# Altium schematic sheet 05_RS485.SchDoc
size A3
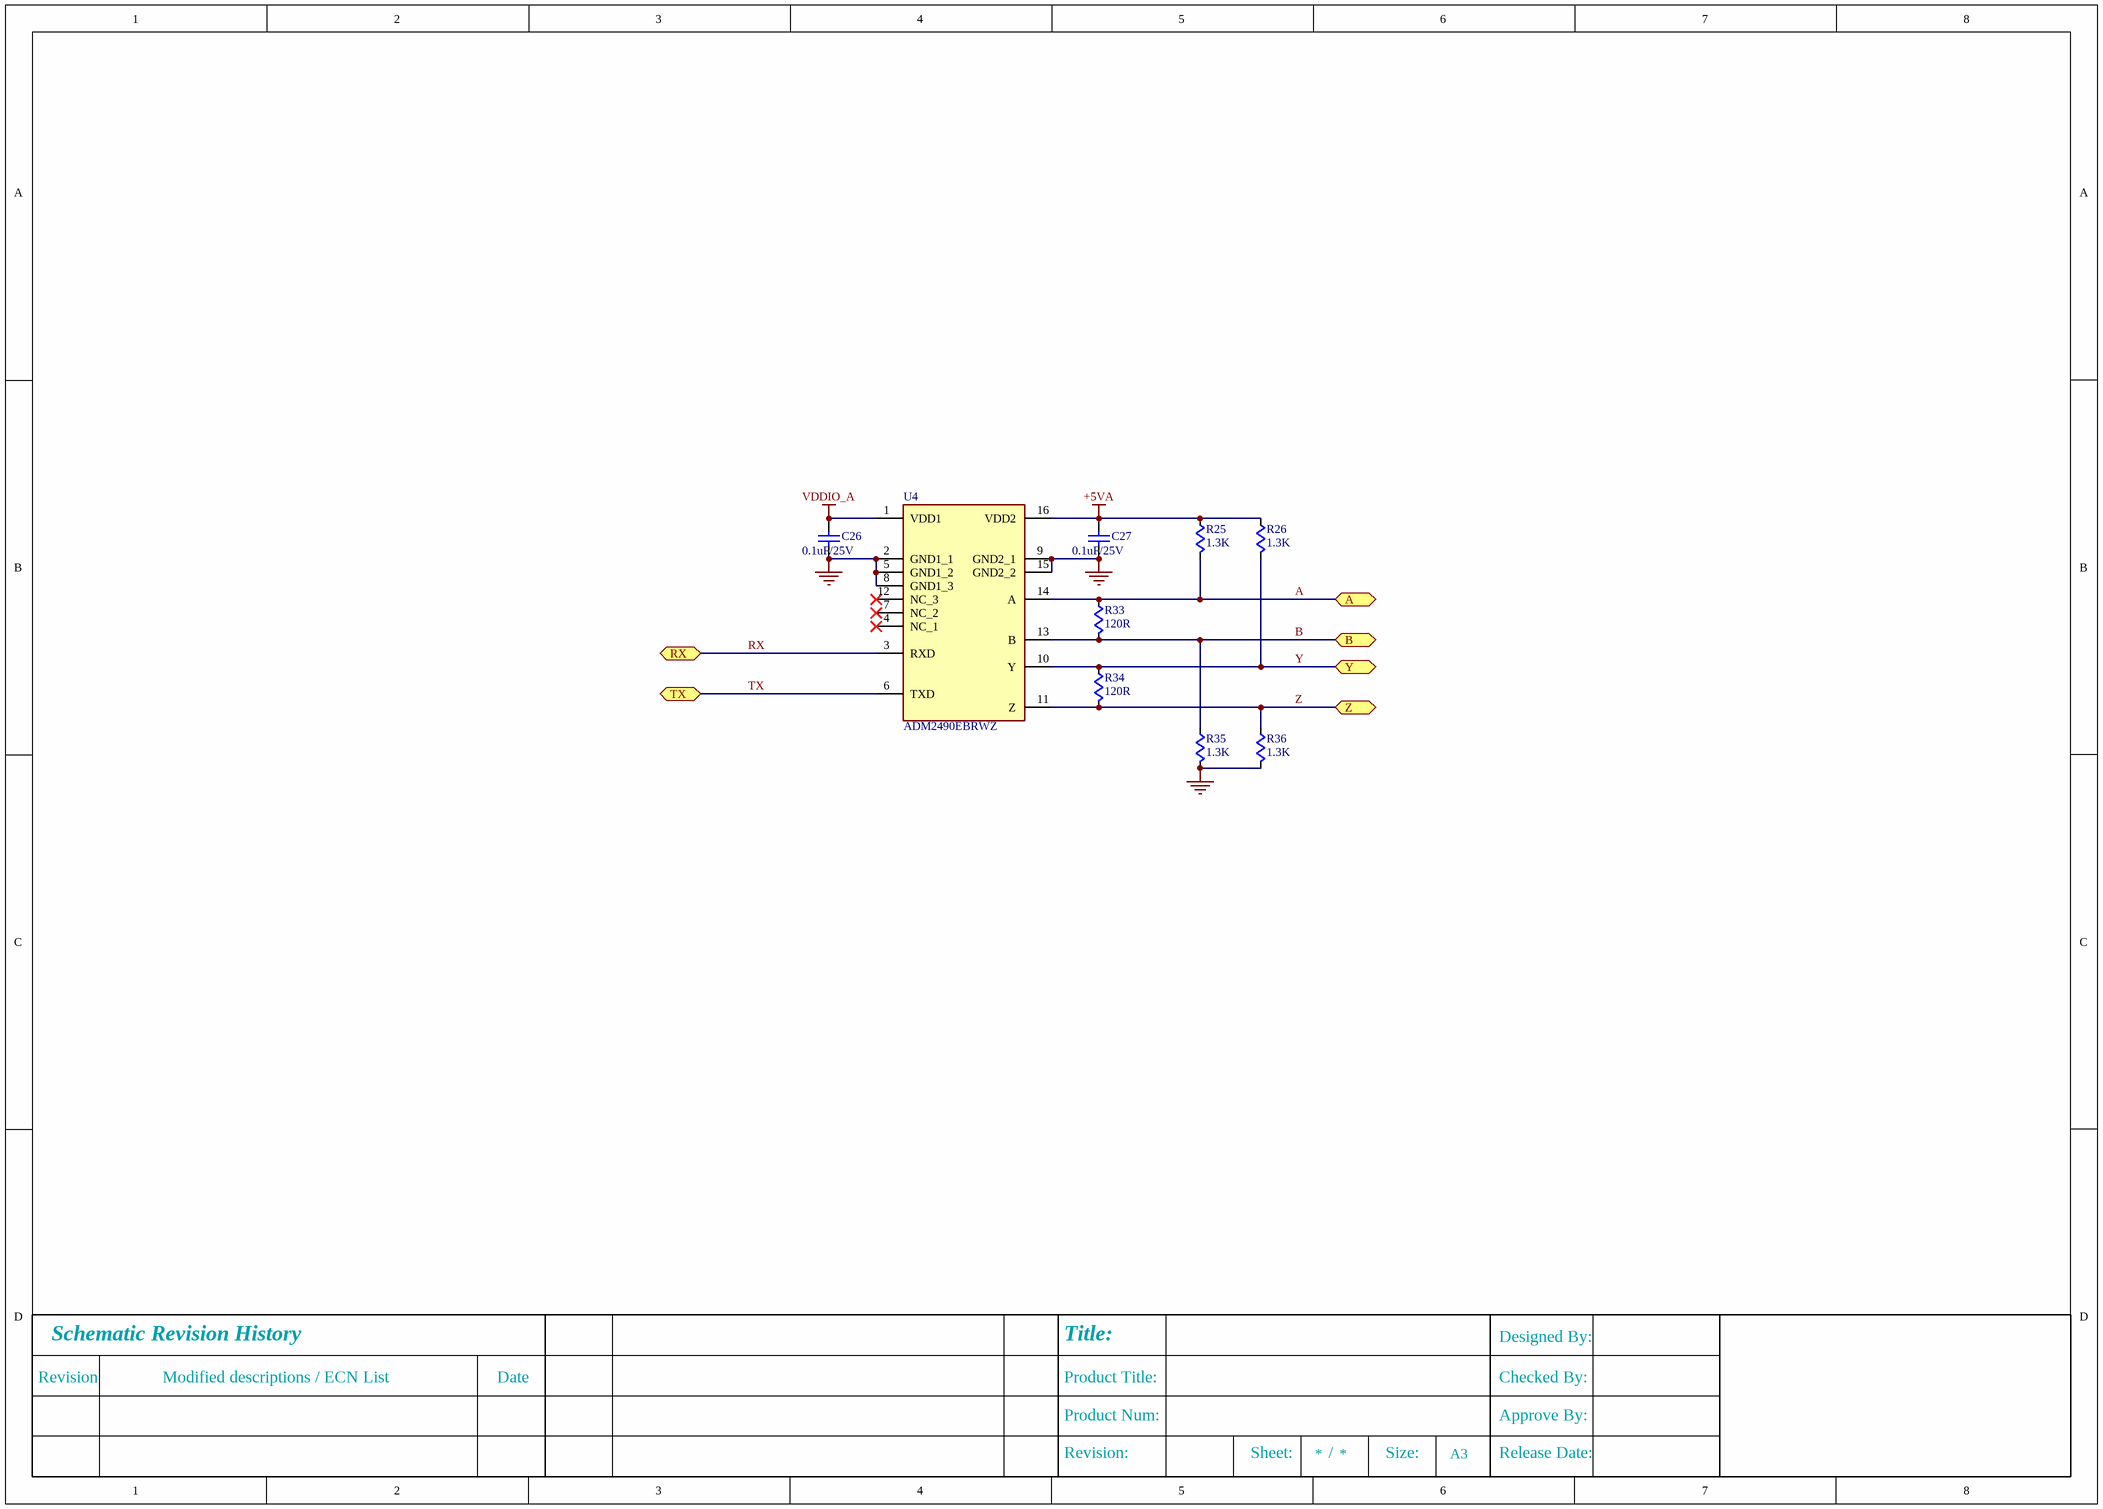
[diagram p0: 05_RS485.SchDoc]

## Parts
C26  0.1uF/25V  [C0603]
C27  0.1uF/25V  [C0603]
R25  1.3K  [R0603]
R26  1.3K  [R0603]
R33  120R  [R0603]
R34  120R  [R0603]
R35  1.3K  [R0603]
R36  1.3K  [R0603]
U4  ADM2490EBRWZ  [SOIC127P1032X265-16N]

## Ports
A (bidir), B (bidir), RX (bidir), TX (bidir), Y (bidir), Z (bidir)

## Nets
+5VA: C27.1 R25.1 R26.1 U4.16(VDD2)
GND: C26.2 C27.2 R35.2 R36.2 U4.2(GND1_1) U4.5(GND1_2) U4.8(GND1_3) U4.9(GND2_1) U4.15(GND2_2)
VDDIO_A: C26.1 U4.1(VDD1)
A: R25.2 R33.1 U4.14(A) ; port A
B: R33.2 R35.1 U4.13(B) ; port B
RX: U4.3(RXD) ; port RX
TX: U4.6(TXD) ; port TX
Y: R26.2 R34.1 U4.10(Y) ; port Y
Z: R34.2 R36.1 U4.11(Z) ; port Z

Not connected (* = marked no-connect by the designer): U4 4(NC_1)* 7(NC_2)* 12(NC_3)*

## Notes on the sheet
- Revision
- Schematic Revision History
- Modified descriptions / ECN List
- Date
- Product Title:
- Title:
- Checked By:
- Designed By:
- Revision:
- Product Num:
- Sheet:
- /
- Size:
- A3
- Approve By:
- Release Date:
- Title
- Date:
- Number:
- Time:
- Sheet
- of
- File:

## Library data of the parts
C26 C27 = C: MLCC
R25 R26 R33-R36 = R: 贴片电阻
U4 = ADM2490EBRWZ: Integrated Circuit; Manufacturer_Name: Analog Devices; Datasheet Link: https://datasheet.datasheetarchive.com/originals/distributors/Datasheets-4/DSA-67751.pdf; Height: 2.65mm; Manufacturer_Part_Number: ADM2490EBRWZ; Mouser Part Number: 584-ADM2490EBRWZ; Mouser Price/Stock: https://www.mouser.co.uk/ProductDetail/Analog-Devices/ADM2490EBRWZ?qs=BpaRKvA4VqFSbCEyp2Yp5g%3D%3D; Arrow Part Number: ADM2490EBRWZ; Arrow Price/Stock: https://www.arrow.com/en/products/adm2490ebrwz/analog-devices